# Altium schematic sheet Ethernet.SchDoc
size A3; SheetNumber: 1; SheetTotal: 11
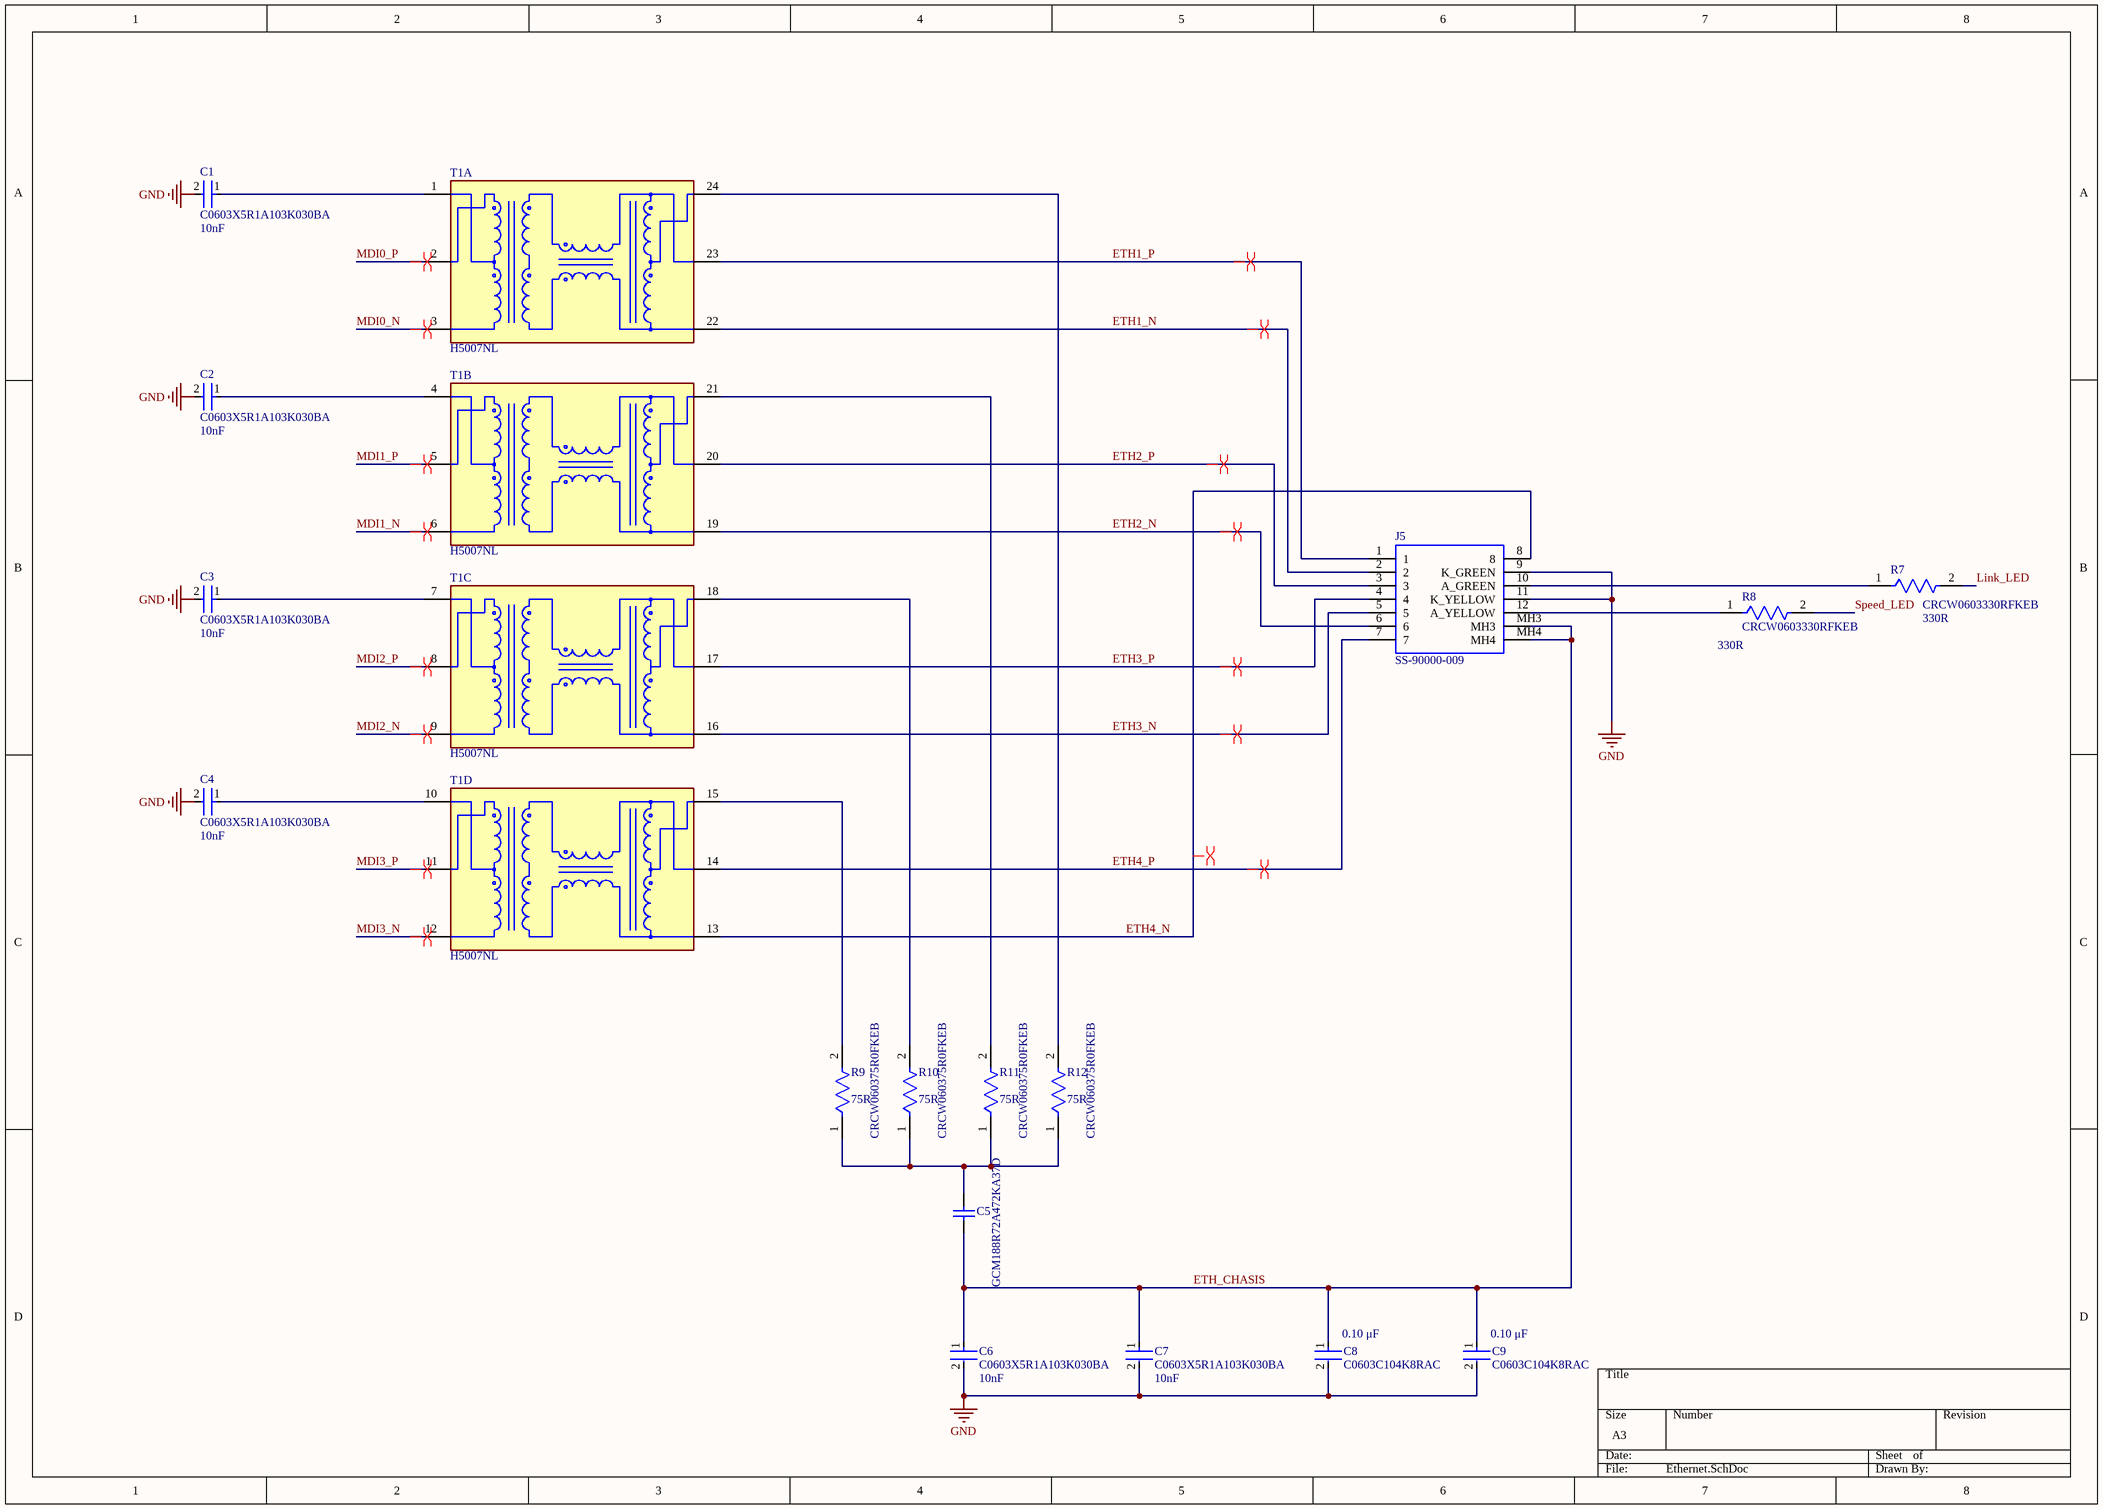
[diagram p0: Ethernet.SchDoc]

## Parts
C1  C0603X5R1A103K030BA  Capacitance: 10nF  [FP-C0603-030-0_03-MFG]
C2  C0603X5R1A103K030BA  Capacitance: 10nF  [FP-C0603-030-0_03-MFG]
C3  C0603X5R1A103K030BA  Capacitance: 10nF  [FP-C0603-030-0_03-MFG]
C4  C0603X5R1A103K030BA  Capacitance: 10nF  [FP-C0603-030-0_03-MFG]
C5  GCM188R72A472KA37D  [CAPC1608X90X35ML10T15]
C6  C0603X5R1A103K030BA  Capacitance: 10nF  [FP-C0603-030-0_03-MFG]
C7  C0603X5R1A103K030BA  Capacitance: 10nF  [FP-C0603-030-0_03-MFG]
C8  C0603C104K8RAC  Capacitance: 0.10 μF  [FP-C0603C-CF-MFG]
C9  C0603C104K8RAC  Capacitance: 0.10 μF  [FP-C0603C-CF-MFG]
J5  SS-90000-009  [SS90000009]
R7  CRCW0603330RFKEB  Resistance: 330R  [FP-CRCW0603-e3-IPC_A]
R8  CRCW0603330RFKEB  Resistance: 330R  [FP-CRCW0603-e3-IPC_A]
R9  CRCW060375R0FKEB  Resistance: 75R  [FP-CRCW0603-e3-IPC_B]
R10  CRCW060375R0FKEB  Resistance: 75R  [FP-CRCW0603-e3-IPC_B]
R11  CRCW060375R0FKEB  Resistance: 75R  [FP-CRCW0603-e3-IPC_B]
R12  CRCW060375R0FKEB  Resistance: 75R  [FP-CRCW0603-e3-IPC_B]
T1  H5007NL  [FP-H5007NL-MFG]  (parts A,B,C,D of 4)

## Nets
GND: C1.2 C2.2 C3.2 C4.2 C6.2 C7.2 C8.2 C9.2 J5.9(K_GREEN) J5.11(K_YELLOW)
ETH1_N: J5.2 T1.22(MX1-)
ETH1_P: J5.1 T1.23(MX1+)
ETH2_N: J5.6 T1.19(MX2-)
ETH2_P: J5.3 T1.20(MX2+)
ETH3_N: J5.5 T1.16(MX3-)
ETH3_P: J5.4 T1.17(MX3+)
ETH4_N: J5.8 T1.13(MX4-)
ETH4_P: J5.7 T1.14(MX4+)
ETH_CHASIS: C5.1 C6.1 C7.1 C8.1 C9.1 J5.MH3 J5.MH4
Link_LED: R7.2
MDI0_N: T1.3(TD1-)
MDI0_P: T1.2(TD1+)
MDI1_N: T1.6(TD2-)
MDI1_P: T1.5(TD2+)
MDI2_N: T1.9(TD3-)
MDI2_P: T1.8(TD3+)
MDI3_N: T1.12(TD4-)
MDI3_P: T1.11(TD4+)
Speed_LED: R8.2
NetC1_1: C1.1 T1.1(TCT1)
NetC2_1: C2.1 T1.4(TCT2)
NetC3_1: C3.1 T1.7(TCT3)
NetC4_1: C4.1 T1.10(TCT4)
NetC5_2: C5.2 R9.1 R10.1 R11.1 R12.1
NetJ5_10: J5.10(A_GREEN) R7.1
NetJ5_12: J5.12(A_YELLOW) R8.1
NetR9_2: R9.2 T1.15(MCT4)
NetR10_2: R10.2 T1.18(MCT3)
NetR11_2: R11.2 T1.21(MCT2)
NetR12_2: R12.2 T1.24(MCT1)

## Layout directives
differential pair: ETH1_N, ETH1_P, ETH2_N, ETH2_P, ETH3_N, ETH3_P, ETH4_N, ETH4_P, MDI0_N, MDI0_P, MDI1_N, MDI1_P, MDI2_N, MDI2_P, MDI3_N, MDI3_P

## Library data of the parts
C1-C4 C6 C7 = CMP-08246-002714-1: Multilayer Ceramic Capacitors 10nF ±10% 10V X5R SMD 0201; Dissipation Factor: 5%; Case Code (Imperial): 0201; Tolerance: 10%; Voltage: 10V; Case/Package: 0201; Width: 0.012inch; Series: C; Construction: Flat; Lead Free: Lead Free; Dielectric: X5R; Depth: 0.3mm; Mount: Surface Mount; Number of Pins: 2; Voltage Rating (DC): 10V; Radiation Hardening: No; Length: 0.6mm; Resistor Type: Ceramic; Dielectric Material: Ceramic; Packaging: Tape and Reel; Height: 0.3mm; Package Quantity: 1; RoHS Compliant: Yes; Thickness: 0.013inch; Min Operating Temperature: -55°C; Voltage Rating: 10V; Case Code (Metric): 0603; Weight: 6E-06oz; Max Operating Temperature: 85°C; Termination: SMD/SMT
C5 = CMP-2006-02966-1: Manufacturer: Murata; Part Number: GCM188R72A472KA37D
C8 C9 = CMP-03020-006081-2: C0603 0.10 μF X7R 30ppm/°C 10.00% 10 V; Manufacturer: KEMET; Value: 0.10 μF; Material: Ceramic; Automotive Grade: Grade 1; Voltage Rating: 10 V; Tolerance: 0.1; Automotive: Yes; Device Class L2: Capacitors; Height: 0.87mm; Temperature Range High: +125°C; Temperature Coefficient: 30ppm/°C; Temperature Range Low: -55°C; Package: C0603C-CF; Lead Free: Yes; Octopart: https://octopart.com/c0603c104k8rac-kemet-1325403; Manufacturer Part Number: C0603C104K8RAC; Temperature: -55°C to +125°C; Mouser Description: .1UF 10V 10% 0603; RoHS: TRUE; ComponentLink2URL: https://api.kemet.com/component-edge/download/datasheet/C0603C100J5GACAUTO.pdf; ComponentLink2Description: Datasheet; Temperature Characteristic: X7R; Device Class L1: Passive Components; Category: Cap; Device Class L3: Ceramic Capacitors
J5 = SS-90000-009: RJ45 8P8C Essential Jack; Manufacturer_Name: BelFuse; Geometry.Height: 13.38mm; Mouser Part Number: 530-SS-90000-009; Mouser Price/Stock: https://www.mouser.co.uk/ProductDetail/Stewart-Connector-Bel/SS-90000-009?qs=T%252BzbugeAwjge6q5Vl6EkRg%3D%3D; Manufacturer_Part_Number: SS-90000-009; Datasheet Link: https://www.belfuse.com/resources/drawings/stewartconnector/dr-STW-SS-90000-009.pdf
R7 R8 = CMP-2000-03240-2: RES Thick Film, 330Ω, 1%, 0.1W, 100ppm/°C, 0603; Voltage Rating (DC): 75V; Power Rating: 100mW; Case Code (Metric): 1608; Case/Package: 0603; Voltage Rating: 75V; Min Operating Temperature: -55°C; Tolerance: 1%; Temperature Coefficient: 100ppm/°C; Weight: 7.1E-05oz; Depth: 0.85mm; Package Quantity: 10000; Number of Terminations: 2; Width: 0.85mm; Radiation Hardening: No; Termination: SMD/SMT; Case Code (Imperial): 0603; Packaging: Tape and Reel; Lead Free: Lead Free; Max Power Dissipation: 100mW; Military Standard: Not; Height: 0.02inch; Max Operating Temperature: 155°C; Length: 1.55mm; Composition: Thick Film; Features: Automotive AEC-Q200; Contact Plating: Tin
R9-R12 = CMP-02407-007302-1: RES Thick Film, 75Ω, 1%, 0.1W, 100ppm/°C, 0603; Voltage Rating: 75V; Max Power Dissipation: 100mW; Min Operating Temperature: -55°C; Termination: SMD/SMT; Tolerance: 1%; Case Code (Metric): 1608; Width: 0.033inch; Package Quantity: 10000; Length: 0.061inch; Max Operating Temperature: 155°C; Height: 0.02inch; Number of Terminations: 2; Packaging: Tape and Reel; Case Code (Imperial): 0603; Features: Automotive AEC-Q200; Weight: 7.1E-05oz; Lead Free: Lead Free; Temperature Coefficient: 100ppm/°C; Composition: Thick Film; Power Rating: 100mW; Case/Package: 0603
T1 = CMP-2000-06385-2: MODULE SINGLE GIGABIT LAN 24SOIC; Isolation Voltage: 1.5kV; Insertion Loss: 1dB; Return Loss: -10dB; Turns Ratio: 1:1; Lead/Base Style: Gull Wing; Shielding: Unshielded; Packaging: Rail/Tube; Weight: 0.056438oz; Depth: 16mm; Mount: Surface Mount; Number of Pins: 24; Lead Free: Lead Free; Min Operating Temperature: 0°C; Length: 17.53mm; Package Quantity: 25; Case/Package: Module; Radiation Hardening: No; RoHS Compliant: Yes; Max Operating Temperature: 70°C; Series: -; Width: 12.2mm; Height: 5.51mm; Termination: SMD/SMT; Height - Seated (Max): 5.76mm